# EAGLE design Arduino Watering System V1.00 (EAGLE 8.7.0)
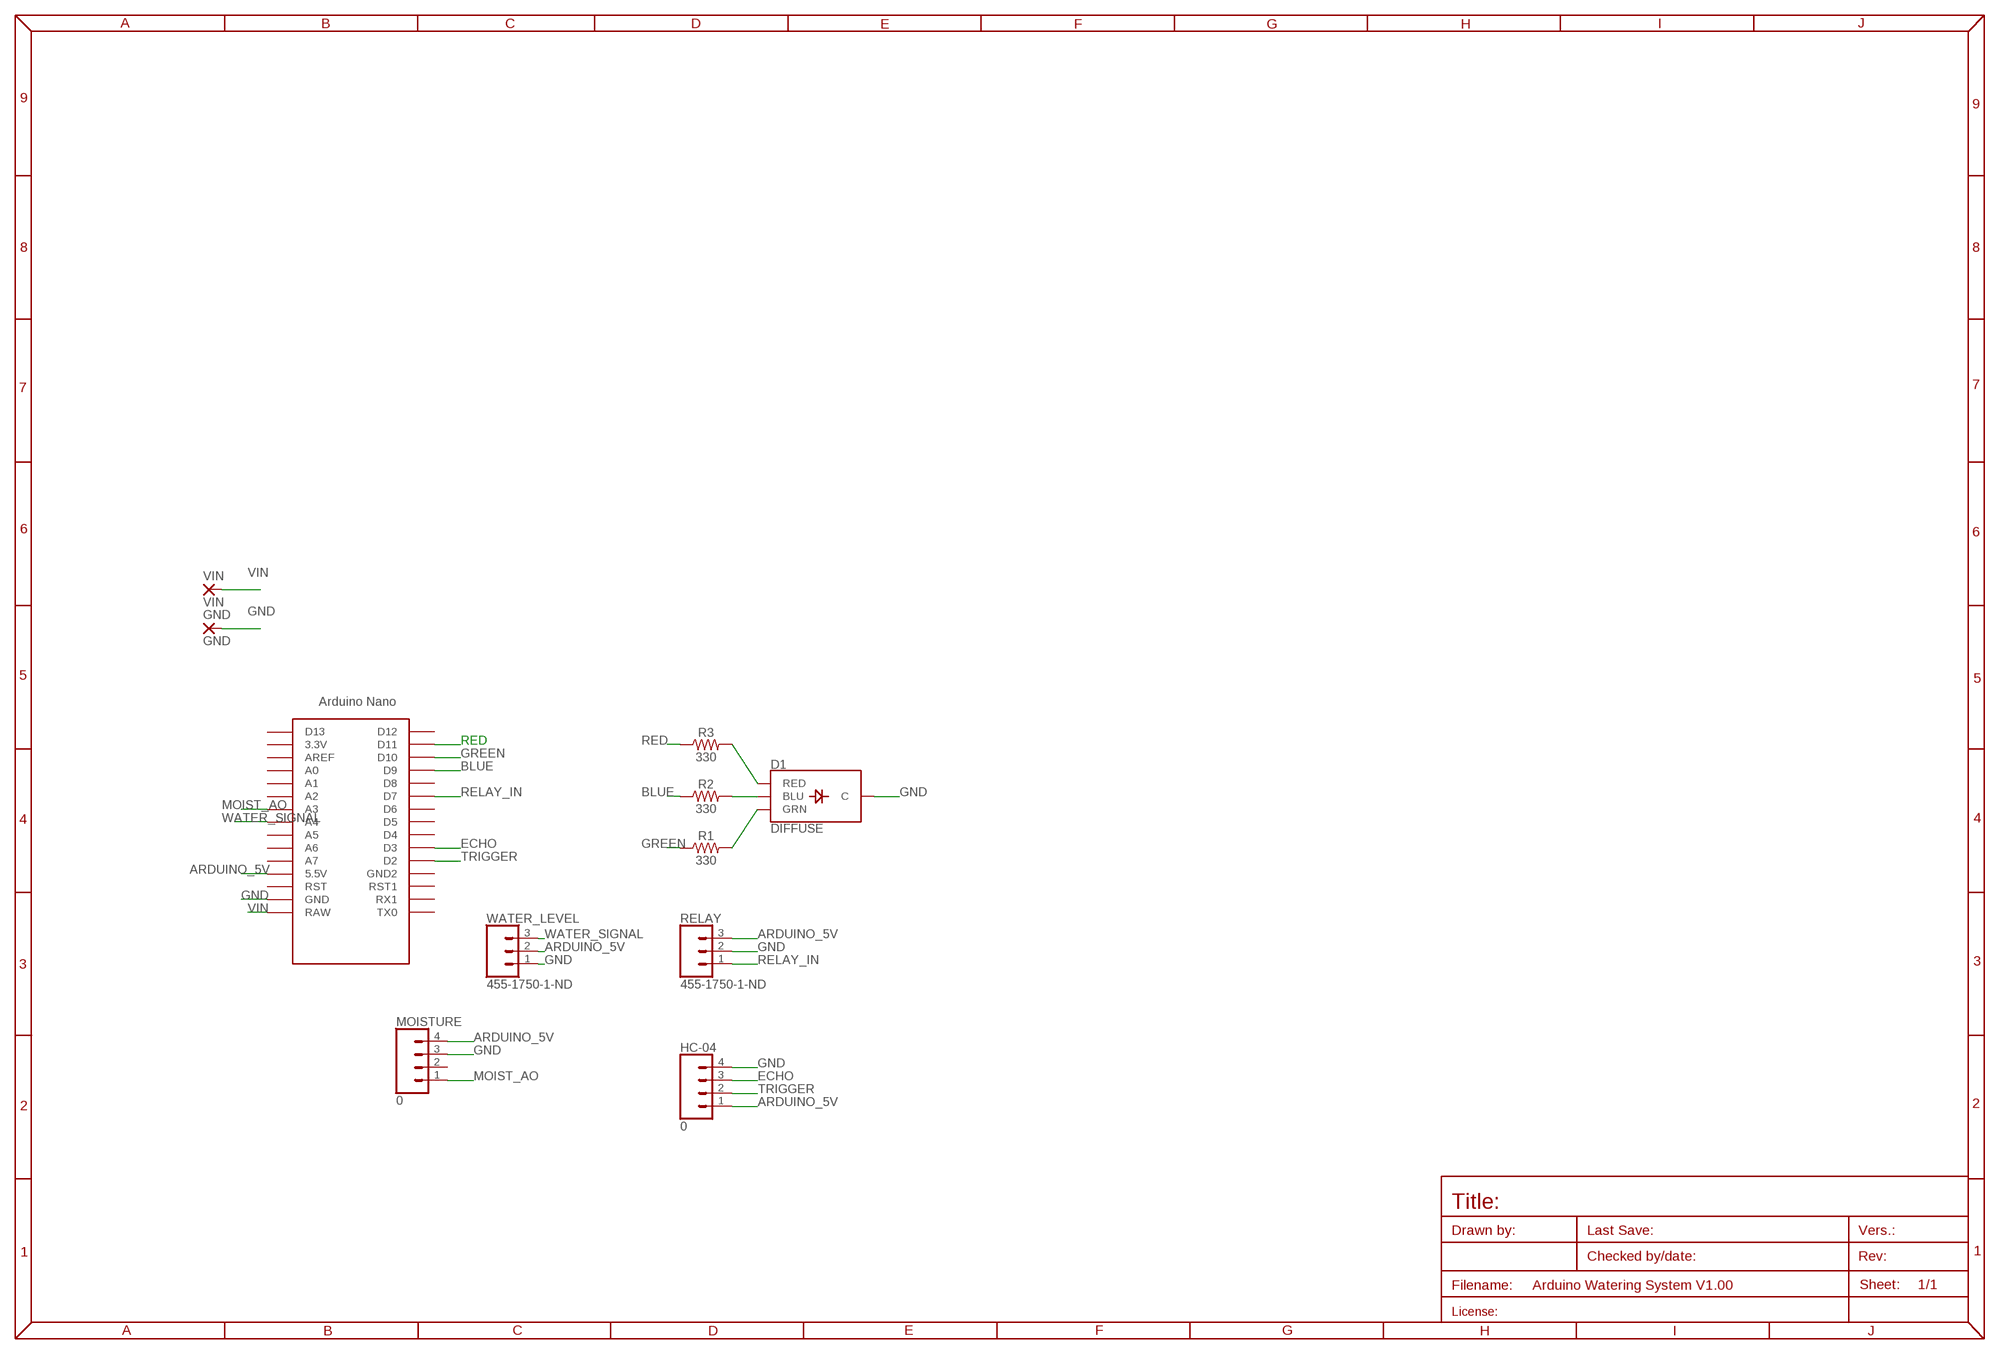
[diagram p0: schematic, sheet 1]
U$2 (A3L-MPAD): DATECHECKED: 27.03.2018; DRAWNBY: NEOLINUX; LICENSE: LGPL; REVISION: 0; TITLE: Arduino Watering System; VERSION: 1.00

## Parts
D1  DIFFUSE  LED-RGB-CCDIFFUSE  [LED-RGB-THRU]
GND  GND  SMD5  [SMD2,54-5,08]
HC-04  0  CONN_04  [1X04]
MOISTURE  0  CONN_04  [1X04]
R1  330  330OHM-HORIZ-1/10W-5%  [AXIAL-0.3]
R2  330  330OHM-HORIZ-1/10W-5%  [AXIAL-0.3]
R3  330  330OHM-HORIZ-1/10W-5%  [AXIAL-0.3]
RELAY  455-1750-1-ND  CONN_03  [1X03]
U$1  NANO  [NANO]
VIN  VIN  SMD5  [SMD2,54-5,08]
WATER_LEVEL  455-1750-1-ND  CONN_03  [1X03]

## Nets
ARDUINO_5V [pwr]: HC-04.1 MOISTURE.4 RELAY.3 U$1.5V(5.5V) WATER_LEVEL.2
BLUE: R2.P$1 U$1.D9
ECHO: HC-04.3 U$1.D3
GND: D1.2(C) GND.1(P) HC-04.4 MOISTURE.3 RELAY.2 U$1.GND WATER_LEVEL.1
GREEN: R1.P$1 U$1.D10
MOIST_AO: MOISTURE.1 U$1.A3
N$1: D1.3(GRN) R1.P$2
N$2: D1.4(BLU) R2.P$2
N$3: D1.1(RED) R3.P$2
RED: R3.P$1 U$1.D11
RELAY_IN: RELAY.1 U$1.D7
TRIGGER: HC-04.2 U$1.D2
VIN: U$1.RAW VIN.1(P)
WATER_SIGNAL: U$1.A4 WATER_LEVEL.3
Unconnected: MOISTURE.2 U$1.3.3V U$1.A0 U$1.A1 U$1.A2 U$1.A5 U$1.A6 U$1.A7 U$1.AREF U$1.D4 U$1.D5 U$1.D6 U$1.D8 U$1.D12 U$1.D13 U$1.GND1(GND2) U$1.ICSP1 U$1.ICSP2 U$1.ICSP3 U$1.ICSP4 U$1.ICSP5 U$1.ICSP6 U$1.RST U$1.RST1 U$1.RX1 U$1.TX0

## Library data of the parts
D1 = SparkFun-LED:LED-RGB-CC: LED-RGB Common Cathode Packages: LED RGB-THRU LED_PIRANHA_5MM SparkFun Products: RGB Diffused Common Cathode- Diffuse <[https://www.sparkfun.com/products/9264]> RGB Diffused Common Cathode - Clear <[https://www.sparkfun.com/products/105]> LED-RGB 5mm Square (Piranha) <[https://www.sparkfun.com/products/11679]>; PROD_ID: DIO-09434
GND VIN = wirepad:SMD5: SMD PAD
HC-04 MOISTURE = SparkFun-Connectors:CONN_04: Multi connection point. Often used as Generic Header-pin footprint for 0.1 inch spaced/style header connections On any of the 0.1 inch spaced packages, you can populate with these: Break Away Headers - Straight <https://www.sparkfun.com/products/116> (PRT-00116) Break Away Male Headers - Right Angle <https://www.sparkfun.com/products/553> (PRT-00553) Female Headers <https://www.sparkfun.com/products/115> (PRT-00115) Break Away Headers - Machine Pin <https://www.sparkfun.com/products/117> (PRT-00117) Break Away Female Headers - Swiss Machine Pin <https://www.sparkfun.com/products/743> (PRT-00743) For SCREWTERMINALS and SPRING TERMINALS visit here: Screw Terimnals on SparkFun.com <https://www.sparkfun.com/search/results?term=Screw+Terminals> (5mm/3.5mm/2.54mm spacing) This device is also useful as a general connection point to wire up your design to another part of your project. Our various solder wires solder well into these plated through hole pads. Hook-Up Wire - Assortment (Stranded, 22 AWG) <https://www.sparkfun.com/products/11375> (PRT-11375) Hook-Up Wire - Assortment (Solid Core, 22 AWG) <https://www.sparkfun.com/products/11367> (PRT-11367) View the entire wire category on our website here <https://www.sparkfun.com/categories/141> Special notes: Molex polarized connector foot print use with SKU : PRT-08231 with associated crimp pins and housings. 1MM SMD Version SKU: PRT-10208; PROD_ID: CONN-09696
R1-R3 = SparkFun-Resistors:330OHM: 330Ω resistor A resistor is a passive two-terminal electrical component that implements electrical resistance as a circuit element. Resistors act to reduce current flow, and, at the same time, act to lower voltage levels within circuits. - Wikipedia; PROD_ID: RES-8371
RELAY WATER_LEVEL = SparkFun-Connectors:CONN_03: Multi connection point. Often used as Generic Header-pin footprint for 0.1 inch spaced/style header connections On any of the 0.1 inch spaced packages, you can populate with these: Break Away Headers - Straight <https://www.sparkfun.com/products/116> (PRT-00116) Break Away Male Headers - Right Angle <https://www.sparkfun.com/products/553> (PRT-00553) Female Headers <https://www.sparkfun.com/products/115> (PRT-00115) Break Away Headers - Machine Pin <https://www.sparkfun.com/products/117> (PRT-00117) Break Away Female Headers - Swiss Machine Pin <https://www.sparkfun.com/products/743> (PRT-00743) Stackable Header - 3 Pin (Female, 0.1") <https://www.sparkfun.com/products/13875> (PRT-13875) For SCREWTERMINALS and SPRING TERMINALS visit here: Screw Terimnals on SparkFun.com <https://www.sparkfun.com/search/results?term=Screw+Terminals> (5mm/3.5mm/2.54mm spacing) This device is also useful as a general connection point to wire up your design to another part of your project. Our various solder wires solder well into these plated through hole pads. Hook-Up Wire - Assortment (Stranded, 22 AWG) <https://www.sparkfun.com/products/11375> (PRT-11375) Hook-Up Wire - Assortment (Solid Core, 22 AWG) <https://www.sparkfun.com/products/11367> (PRT-11367) View the entire wire category on our website here <https://www.sparkfun.com/categories/141> Special notes: Molex polarized connector foot print use with SKU : PRT-08232 with associated crimp pins and housings.; PROD_ID: XXX-00000
U$1 = Arduino-clone:NANO: Arduino Nano

## Net classes
0 default: clearance 0.205 mm
1 pwr: width 0.8 mm, clearance 0.2 mm

## Board
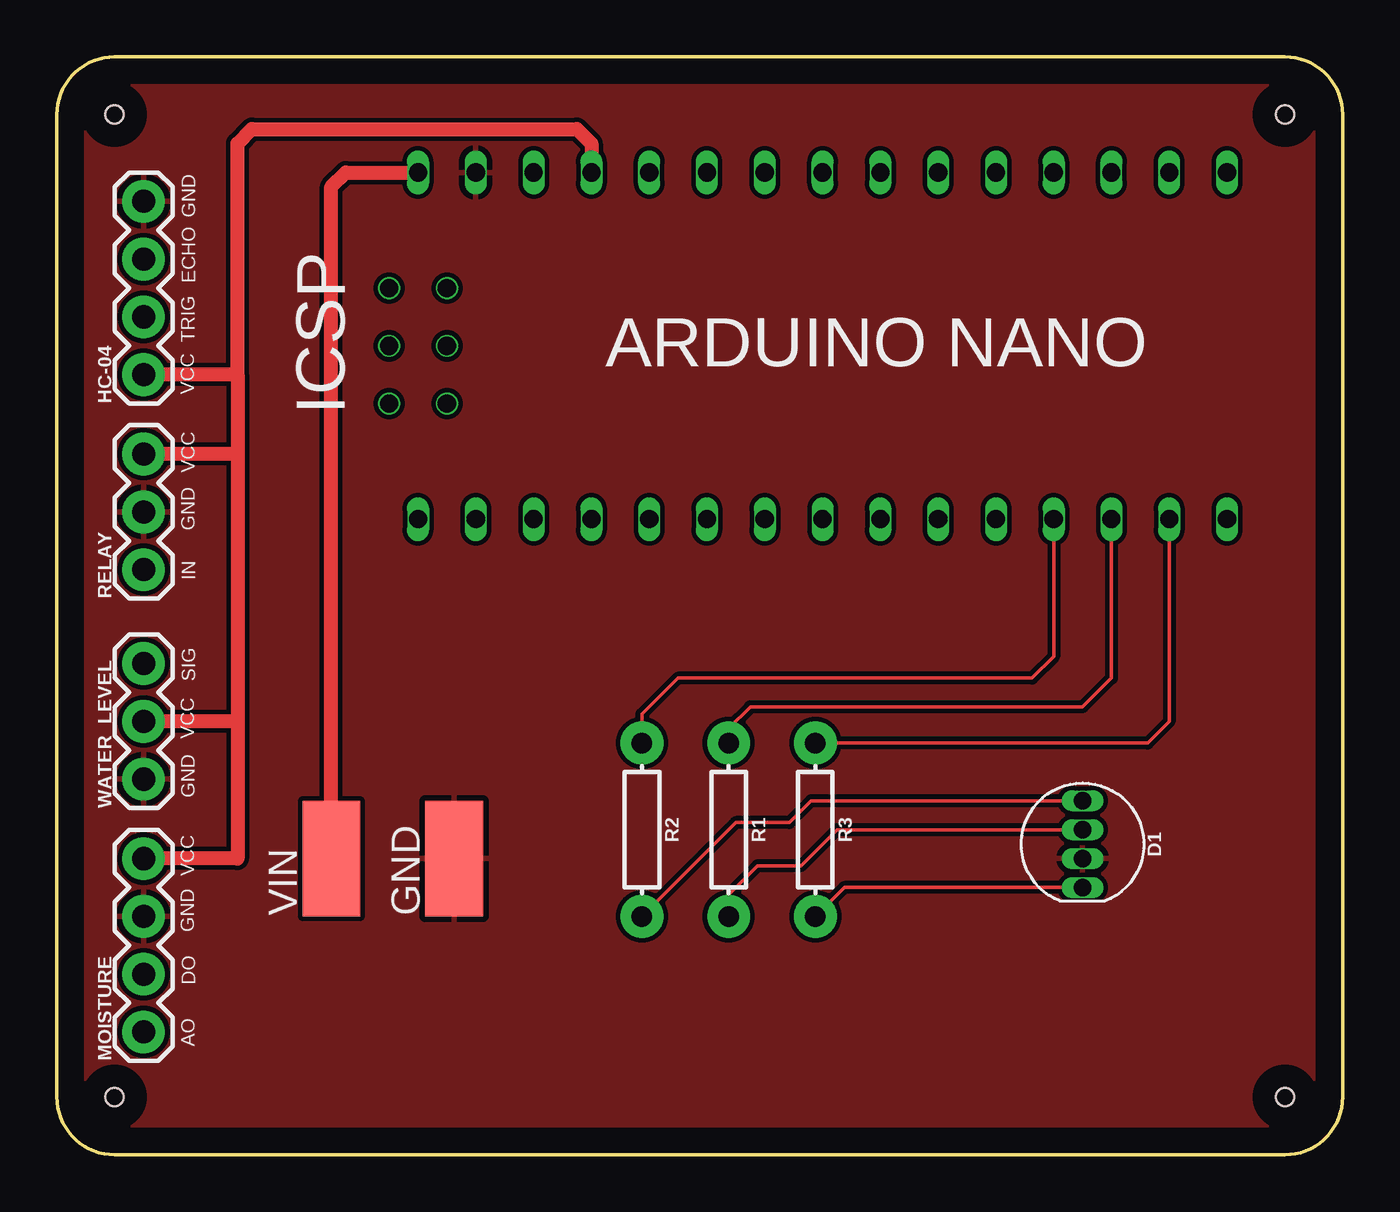
[diagram p1: board, top side]
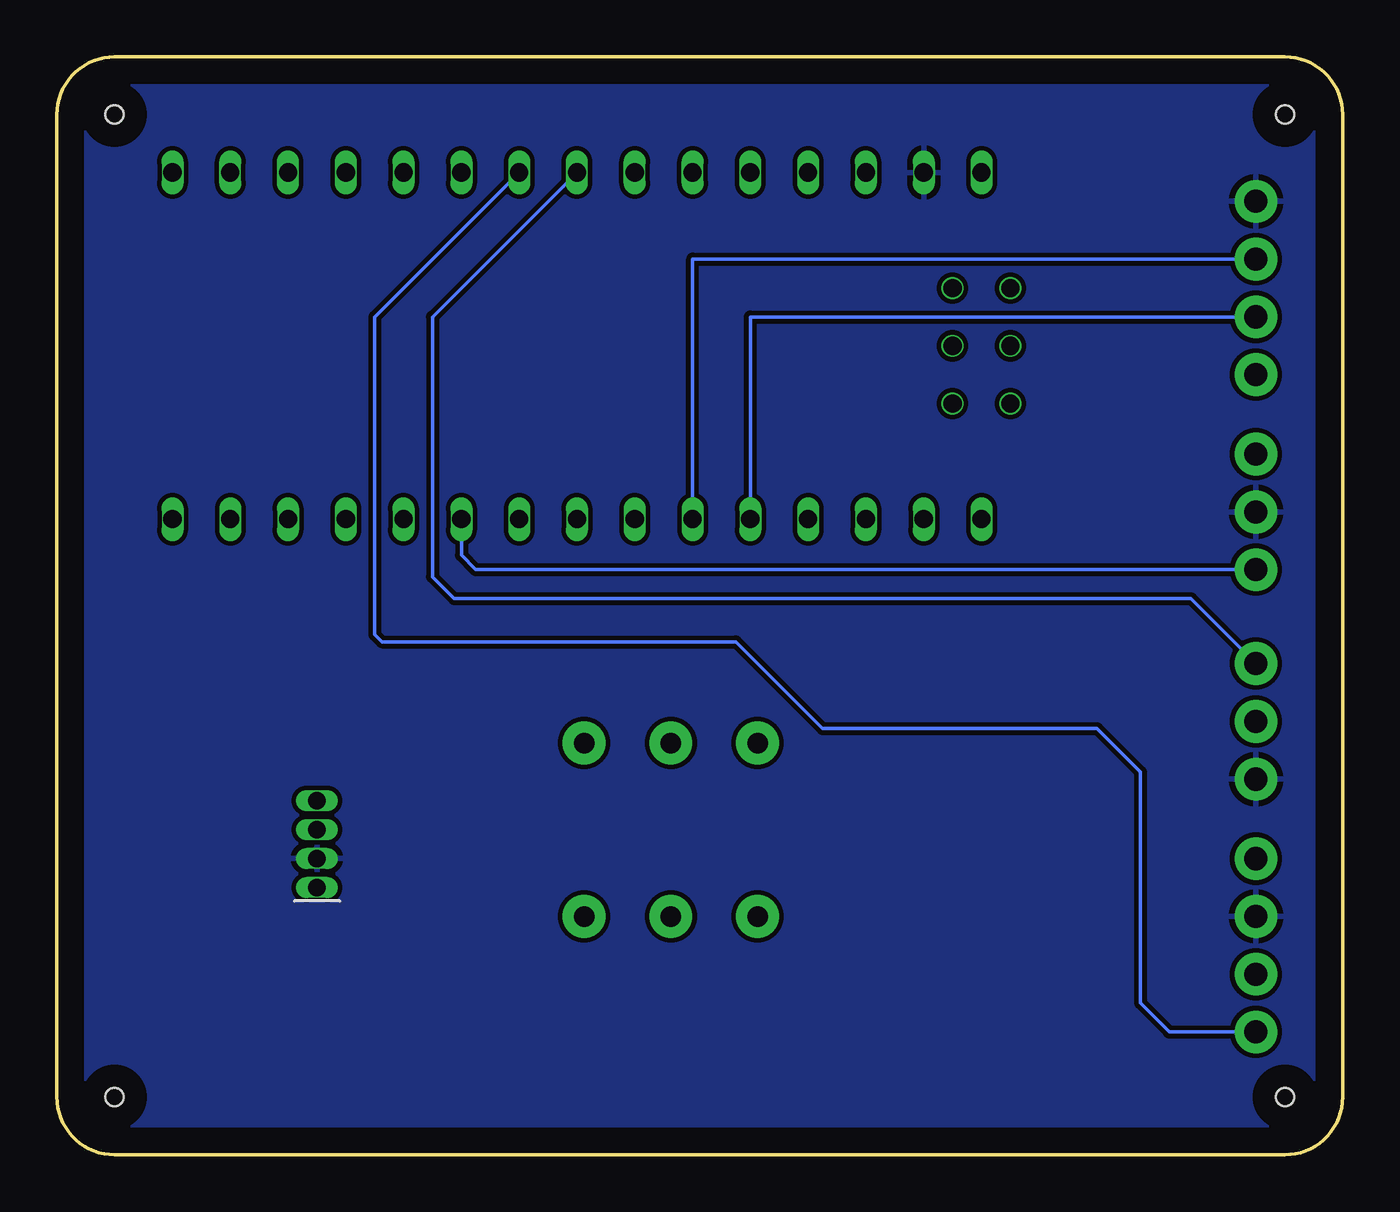
[diagram p2: board, bottom side, seen from below]

Size 56.51 x 48.26 mm. Coordinates in mm from the lower left corner, seen from the top.
Outline: 0,45.72 arc-90 2.54,48.26 53.97,48.26 arc-90 56.51,45.72 56.51,2.54 arc-90 53.97,0 2.54,0 arc-90 0,2.54 0,45.72
Copper layers (1*16): Top 0.035mm / dielectric 1.5mm / Bottom 0.035mm
Design rules "default *": minimum track width 6mil, minimum drill 0.2mm, track to track 6mil, track to pad 6mil, pad to pad 6mil, via to via 6mil, smd to smd 6mil, copper to edge 40mil, drill to drill 6mil, minimum pad ring 0mil, minimum via ring 8mil, stop-mask expansion 4mil, vias tented up to drill 0mil, thermal gap 10mil
Holes 0.8 mm at 2.54,45.72 53.97,45.72 53.97,2.54 2.54,2.54

### Footprints (pad centres in the part's own frame; a part is rotated, then mirrored left to right if it is on the bottom)
LED-RGB-THRU = drill 0.762 pad 0.889 long: 1 1.905,0; 2 0.635,0; 3 -0.635,0; 4 -1.905,0
SMD2,54-5,08 = smd 2.54 x 5.08: 1 0,0
1X04 = drill 1.016 pad 1.88: 1 0,0; 2 2.54,0; 3 5.08,0; 4 7.62,0
AXIAL-0.3 = drill 0.9 pad 1.88: P$1 -3.81,0; P$2 3.81,0
1X03 = drill 1.016 pad 1.88: 1 0,0; 2 2.54,0; 3 5.08,0
NANO = drill 0.8 long: 3.3V -10.16,24.13; 5V -10.16,-1.27; A0 -10.16,19.05; A1 -10.16,16.51; A2 -10.16,13.97; A3 -10.16,11.43; A4 -10.16,8.89; A5 -10.16,6.35; A6 -10.16,3.81; A7 -10.16,1.27; AREF -10.16,21.59; D2 5.08,1.27; D3 5.08,3.81; D4 5.08,6.35; D5 5.08,8.89; D6 5.08,11.43; D7 5.08,13.97; D8 5.08,16.51; D9 5.08,19.05; D10 5.08,21.59; D11 5.08,24.13; D12 5.08,26.67; D13 -10.16,26.67; GND -10.16,-6.35; GND1 5.08,-1.27; RAW -10.16,-8.89; RST -10.16,-3.81; RST1 5.08,-3.81; RX1 5.08,-6.35; TX0 5.08,-8.89 | drill 0.8: ICSP1 -5.08,-10.16; ICSP2 -5.08,-7.62; ICSP3 -2.54,-10.16; ICSP4 -2.54,-7.62; ICSP5 0,-10.16; ICSP6 0,-7.62

### Placement (x,y rotation side)
D1  45.08,13.65 270 top
GND  17.46,13.02 0 top
HC-04  3.81,34.29 90 top
MOISTURE  3.81,5.4 90 top
R1  29.53,14.29 270 top
R2  25.72,14.29 270 top
R3  33.34,14.29 270 top
RELAY  3.81,25.72 90 top
U$1  24.77,33.02 270 top
VIN  12.07,13.02 0 top
WATER_LEVEL  3.81,16.51 90 top

### Tracks (layer width: path | path; a pad name or v marks a point on that pad's centre or on a via)
ARDUINO_5V
  Top 0.61: 7.94,34.29 HC-04.1 | 7.94,34.29 7.94,30.8 | 7.94,30.8 RELAY.3 | 7.94,30.8 7.94,19.05 | 7.94,19.05 WATER_LEVEL.2 | 7.94,19.05 7.94,13.02 MOISTURE.4 | 7.94,34.29 7.94,44.45 8.57,45.08 22.86,45.08 23.5,44.45 U$1.5V
BLUE
  Top 0.152: U$1.D9 43.81,21.91 42.86,20.96 27.3,20.96 25.72,19.37 R2.P$1
ECHO
  Bottom 0.152: U$1.D3 28.57,39.37 HC-04.3
GND
  pour Top: 1.27,45.72 arc-90 2.54,46.99 53.97,46.99 arc-90 55.24,45.72 55.24,2.54 arc-90 53.97,1.27 2.54,1.27 arc-90 1.27,2.54
  pour Bottom: 1.27,45.72 arc-90 2.54,46.99 53.97,46.99 arc-90 55.24,45.72 55.24,2.54 arc-90 53.97,1.27 2.54,1.27 arc-90 1.27,2.54
GREEN
  Top 0.152: U$1.D10 46.35,20.96 45.08,19.68 30.48,19.68 29.53,18.73 R1.P$1
MOIST_AO
  Bottom 0.152: U$1.A3 42.54,36.83 42.54,22.86 42.23,22.54 26.67,22.54 22.86,18.73 10.79,18.73 8.89,16.83 8.89,6.67 7.62,5.4 MOISTURE.1
N$1
  Top 0.152: D1.3 34.29,14.29 32.7,12.7 30.8,12.7 29.53,11.43 R1.P$2
N$2
  Top 0.152: D1.4 33.15,15.56 32.2,14.61 29.84,14.61 R2.P$2
  Bottom 0.152: R2.P$2
N$3
  Top 0.152: D1.1 34.61,11.75 R3.P$2
RED
  Top 0.152: U$1.D11 48.89,19.05 47.94,18.1 R3.P$1
RELAY_IN
  Top 0.152: 3.84,25.75 RELAY.1
  Bottom 0.152: RELAY.1 38.1,25.72 38.73,26.35 U$1.D7
TRIGGER
  Bottom 0.152: U$1.D2 26.04,36.83 HC-04.2
VIN
  Top 0.61: VIN.1 12.07,42.54 12.7,43.18 U$1.RAW
WATER_SIGNAL
  Bottom 0.152: U$1.A4 40,36.83 40,25.4 39.05,24.45 6.67,24.45 WATER_LEVEL.3

### Text on the board
tPlace: GND | ICSP | ECHO | ARDUINO NANO | TRIG | VCC | VCC | GND | IN | SIG | VCC | GND | VCC | GND | DO | AO
tStop: Arduino Watering System v1.00
bStop: Arduino Watering System v1.00